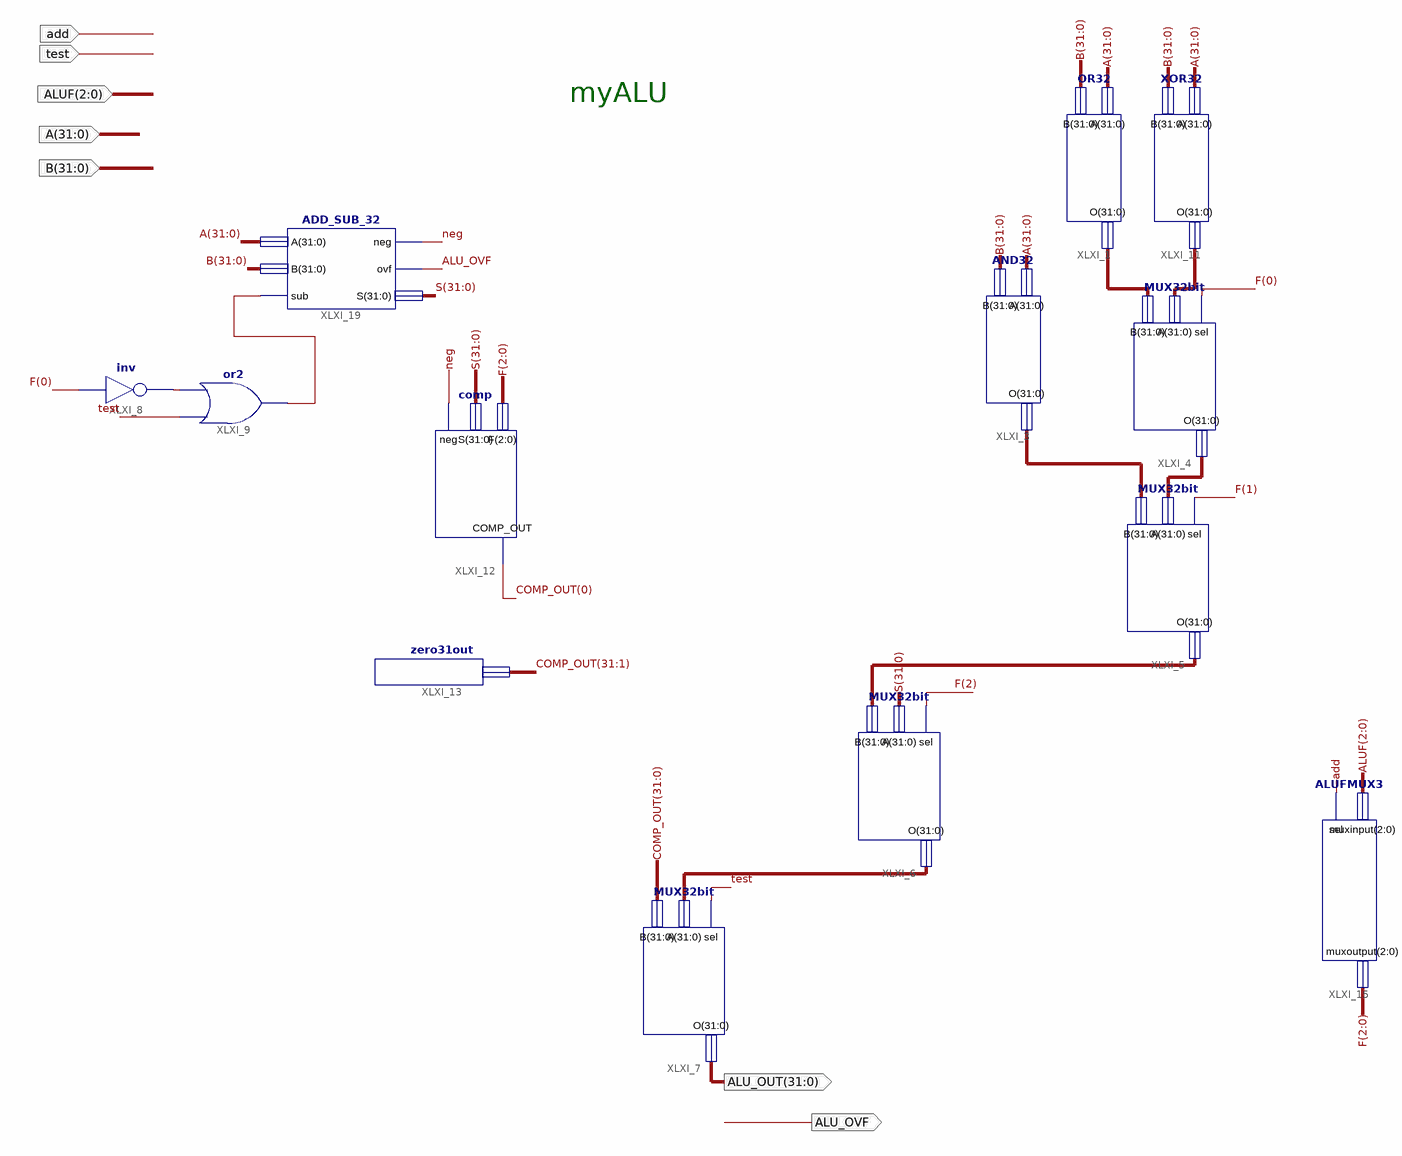
[diagram p0: schematic sheet 1]
// Xilinx ISE schematic myALU_device.sch (spartan3) as structural Verilog: 13 symbols, 7 ports
module myALU_device (
  input  test,
  input  [2:0] ALUF,
  input  [31:0] A,
  input  [31:0] B,
  input  add,
  output [31:0] ALU_OUT,
  output ALU_OVF
);

  wire neg, XLXN_1, XLXN_119;
  wire [2:0] F;
  wire [31:0] COMP_OUT, S, XLXN_20, XLXN_25, XLXN_41, XLXN_46, XLXN_50, XLXN_74;

  MUX32bit XLXI_7 (.sel(test), .A(XLXN_74), .B(COMP_OUT), .O(ALU_OUT));
  MUX32bit XLXI_5 (.sel(F[1]), .A(XLXN_41), .B(XLXN_46), .O(XLXN_50));
  MUX32bit XLXI_4 (.sel(F[0]), .A(XLXN_20), .B(XLXN_25), .O(XLXN_41));
  AND32 XLXI_3 (.A(A), .B(B), .O(XLXN_46));
  MUX32bit XLXI_6 (.sel(F[2]), .A(S), .B(XLXN_50), .O(XLXN_74));
  XOR32 XLXI_11 (.A(A), .B(B), .O(XLXN_20));
  OR32 XLXI_1 (.A(A), .B(B), .O(XLXN_25));
  ALUFMUX3 XLXI_15 (.muxinput(ALUF), .sel(add), .muxoutput(F));
  ADD_SUB_32 XLXI_19 (.A(A), .B(B), .sub(XLXN_119), .neg(neg), .ovf(ALU_OVF), .S(S));
  or XLXI_9 (XLXN_119, test, XLXN_1);
  not XLXI_8 (XLXN_1, F[0]);
  comp XLXI_12 (.F(F), .S(S), .neg(neg), .COMP_OUT(COMP_OUT[0]));
  zero31out XLXI_13 (.O(COMP_OUT[31:1]));

  // Notes on the sheet:
  //   myALU
endmodule
